# Altium schematic sheet Sensor.SchDoc
size A3
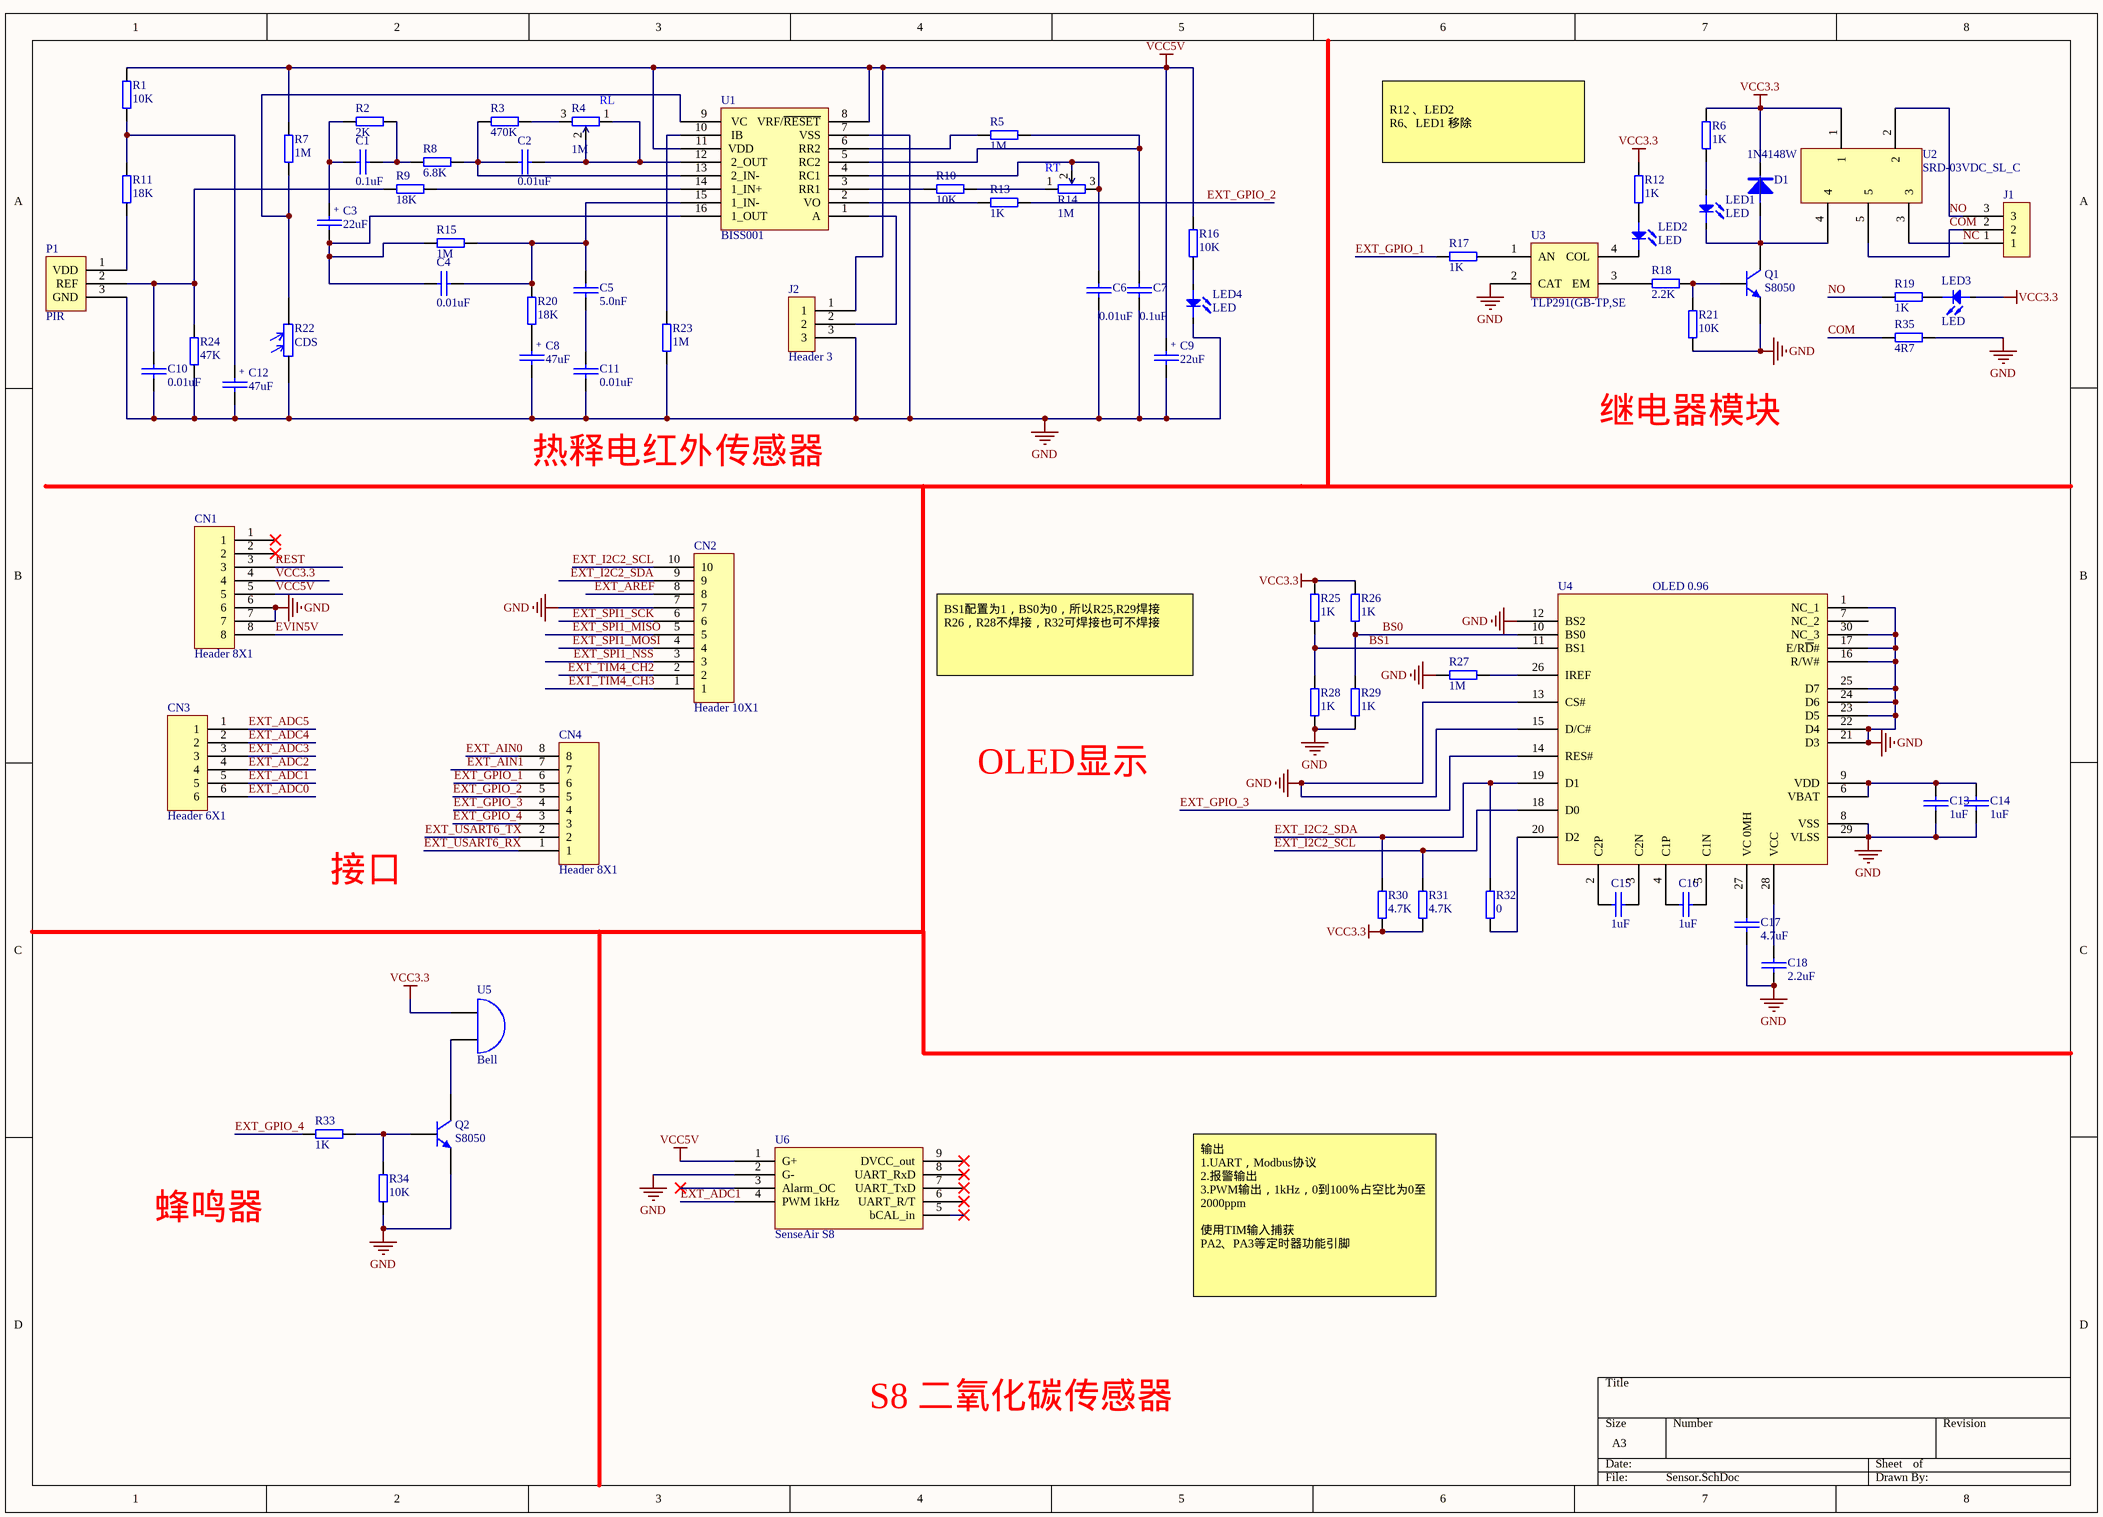
[diagram p0: Sensor.SchDoc]

## Parts
C1  0.1uF  [0603 - CAP]
C2  0.01uF  [0603 - CAP]
C3  22uF  [C-钽贴A(S)_3216M_18(12)]
C4  0.01uF  [0603 - CAP]
C5  5.0nF  [0603 - CAP]
C6  0.01uF  [0603 - CAP]
C7  0.1uF  [0603 - CAP]
C8  47uF  [C-钽贴A(S)_3216M_18(12)]
C9  22uF  [C-钽贴A(S)_3216M_18(12)]
C10  0.01uF  [0603 - CAP]
C11  0.01uF  [0603 - CAP]
C12  47uF  [C-钽贴A(S)_3216M_18(12)]
C13  1uF  [0603 - CAP]
C14  1uF  [0603 - CAP]
C15  1uF  [0603 - CAP]
C16  1uF  [0603 - CAP]
C17  4.7uF  [0603 - CAP]
C18  2.2uF  [0603 - CAP]
CN1  Header 8X1  [HDR1X8]
CN2  Header 10X1  [HDR1X10]
CN3  Header 6X1  [HDR1X6]
CN4  Header 8X1  [HDR1X8]
D1  1N4148W  [1N4148W]
J1  (no value)  [HDR1X3 - duplicate1]
J2  Header 3  [HDR1X3 - duplicate1]
LED1  LED  [0603-LED]
LED2  LED  [0603-LED]
LED3  LED  [0603-LED]
LED4  LED  [0603-LED]
P1  PIR  [PIR]
Q1  S8050  [TO-92_3]
Q2  S8050  [TO-92_3]
R1  10K  [0603 - RES]
R2  2K  [0603 - RES]
R3  470K  [0603 - RES]
R4  1M  [3296W]
R5  1M  [0603 - RES]
R6  1K  [0603 - RES]
R7  1M  [0603 - RES]
R8  6.8K  [0603 - RES]
R9  18K  [0603 - RES]
R10  10K  [0603 - RES]
R11  18K  [0603 - RES]
R12  1K  [0603 - RES]
R13  1K  [0603 - RES]
R14  1M  [3296W]
R15  1M  [0603 - RES]
R16  10K  [0603 - RES]
R17  1K  [0603 - RES]
R18  2.2K  [0603 - RES]
R19  1K  [0603 - RES]
R20  18K  [0603 - RES]
R21  10K  [0603 - RES]
R22  CDS  [RES-guangmin]
R23  1M  [0603 - RES]
R24  47K  [0603 - RES]
R25  1K  [0603 - RES]
R26  1K  [0603 - RES]
R27  1M  [0603 - RES]
R28  1K  [0603 - RES]
R29  1K  [0603 - RES]
R30  4.7K  [0603 - RES]
R31  4.7K  [0603 - RES]
R32  0  [0603 - RES]
R33  1K  [0603 - RES]
R34  10K  [0603 - RES]
R35  4R7  [0603 - RES]
U1  BISS001  [SOP-16_150mil]
U2  SRD-03VDC_SL_C  [SRD-03VDC-SL-C]
U3  TLP291(GB-TP,SE  [TLP291(GB-TP,SE]
U4  OLED 0.96  [oled 0.96]
U5  Bell  [BUZZER_mini]
U6  SenseAir S8  [SenseAir S8]

## Nets
GND: C6.2 C7.2 C8.2 C9.2 C10.2 C11.2 C12.2 C13.1 C14.1 C17.1 C18.1 CN1.6 CN1.7 CN2.7 J2.3 LED4.2 P1.3(GND) Q1.1(E) Q2.1(E) R21.2 R22.1 R23.1 R24.1 R27.2 R28.1 R29.1 R34.1 R35.2 U1.7(VSS) U3.2(CAT) U4.1(NC_1) U4.8(VSS) U4.12(BS2) U4.13(CS#) U4.15(D/C#) U4.16(R/W#) U4.17(E/R~{D}#) U4.21(D3) U4.22(D4) U4.23(D5) U4.24(D6) U4.25(D7) U4.29(VLSS) U4.30(NC_3) U6.2(G-)
VCC3.3: CN1.4 D1.2(K) LED3.1 R6.2 R12.2 R25.2 R26.2 R30.1 R31.1 U2.1 U5.1(A)
VCC5V: C9.1 CN1.5 J2.1 R1.2 R7.2 R16.2 U1.8(VRF/~{RESET}) U1.11(VDD) U6.1(G+)
BS0: R26.1 R29.2 U4.10(BS0)
BS1: R25.1 R28.2 U4.11(BS1)
COM: J1.2 R35.1 U2.5
EVIN5V: CN1.8
EXT_ADC0: CN3.6
EXT_ADC1: CN3.5 U6.4(PWM_1kHz)
EXT_ADC2: CN3.4
EXT_ADC3: CN3.3
EXT_ADC4: CN3.2
EXT_ADC5: CN3.1
EXT_AIN0: CN4.8
EXT_AIN1: CN4.7
EXT_AREF: CN2.8
EXT_GPIO_1: CN4.6 R17.1
EXT_GPIO_2: CN4.5 R13.2
EXT_GPIO_3: CN4.4 U4.14(RES#)
EXT_GPIO_4: CN4.3 R33.1
EXT_I2C2_SCL: CN2.10 R31.2 U4.18(D0)
EXT_I2C2_SDA: CN2.9 R30.2 R32.2 U4.19(D1)
EXT_SPI1_MISO: CN2.5
EXT_SPI1_MOSI: CN2.4
EXT_SPI1_NSS: CN2.3
EXT_SPI1_SCK: CN2.6
EXT_TIM4_CH2: CN2.2
EXT_TIM4_CH3: CN2.1
EXT_USART6_RX: CN4.1
EXT_USART6_TX: CN4.2
NC: J1.1 U2.3
NO: J1.3 R19.1 U2.2
REST: CN1.3
NetC1_1: C1.1 R2.2 R8.1
NetC1_2: C1.2 C3.1 R2.1
NetC2_1: C2.1 R3.1 R8.2 U1.13(2_IN-)
NetC2_2: C2.2 R4.1 R4.2 U1.12(2_OUT)
NetC3_2: C3.2 C4.1 R15.2 U1.16(1_OUT)
NetC4_2: C4.2 C5.1 R15.1 R20.2 U1.15(1_IN-)
NetC5_2: C5.2 C11.1
NetC6_1: C6.1 R14.2 R14.3 U1.4(RC1)
NetC7_1: C7.1 R5.1 U1.5(RC2)
NetC8_1: C8.1 R20.1
NetC10_1: C10.1 P1.2(REF) R9.2 R24.2
NetC12_1: C12.1 R1.1 R11.2
NetC13_2: C13.2 C14.2 U4.6(VBAT) U4.9(VDD)
NetC15_1: C15.1 U4.3(C2N)
NetC15_2: C15.2 U4.2(C2P)
NetC16_1: C16.1 U4.5(C1N)
NetC16_2: C16.2 U4.4(C1P)
NetC17_2: C17.2 U4.27(VC_0MH)
NetC18_2: C18.2 U4.28(VCC)
NetD1_1: D1.1(A) LED1.2 Q1.3(C) U2.4
NetJ2_2: J2.2 U1.1(A)
NetLED1_1: LED1.1 R6.1
NetLED2_1: LED2.1 R12.1
NetLED2_2: LED2.2 U3.4(COL)
NetLED3_2: LED3.2 R19.2
NetLED4_1: LED4.1 R16.1
NetP1_1: P1.1(VDD) R11.1
NetQ1_2: Q1.2(B) R18.1 R21.1
NetQ2_2: Q2.2(B) R33.2 R34.2
NetQ2_3: Q2.3(C) U5.2(B)
NetR3_2: R3.2 R4.3
NetR5_2: R5.2 U1.6(RR2)
NetR7_1: R7.1 R22.2 U1.9(VC)
NetR9_1: R9.1 U1.14(1_IN+)
NetR10_1: R10.1 R14.1
NetR10_2: R10.2 U1.3(RR1)
NetR13_1: R13.1 U1.2(VO)
NetR17_2: R17.2 U3.1(AN)
NetR18_2: R18.2 U3.3(EM)
NetR23_2: R23.2 U1.10(IB)
NetR27_1: R27.1 U4.26(IREF)
NetR32_1: R32.1 U4.20(D2)

Not connected (* = marked no-connect by the designer): CN1 1* 2*; U4 7(NC_2); U6 3(Alarm_OC)* 5(bCAL_in)* 6(UART_R/T)* 7(UART_TxD)* 8(UART_RxD)* 9(DVCC_out)*

## Notes on the sheet
- (near R4) RL
- (near R14) RT
- R12 、LED2
  R6、LED1 移除
- 继电器模块
- 热释电红外传感器
- BS1配置为1，BS0为0，所以R25,R29焊接
  R26，R28不焊接，R32可焊接也可不焊接
- OLED显示
- 接口
- 蜂鸣器
- 输出
  1.UART，Modbus协议
  2.报警输出
  3.PWM输出，1kHz，0到100％占空比为0至2000ppm
  使用TIM输入捕获
  PA2、PA3等定时器功能引脚
- S8 二氧化碳传感器
- (in symbol Capacity_electric) +

## Library data of the parts
C1 C7 = Capacity_normal: MAnufactor: YAGEO(国巨); Value: 100nF(104) ±10% 10V; Package: 0603
C2 C4 C6 C10 C11 = Capacity_normal: MAnufactor: YAGEO(国巨); Value: 10nF(103) ±10% 10V; Package: 0603
C3 C9 = Capacity_electric: Manufactor: SAMSUNG(三星); Value: 22uF(226) ±20% 6.3V; Package: 0603
C5 = Capacity_normal: MAnufactor: FH(风华); Value: 5.0nF(502) ±10% 50V; Package: 0603
C8 C12 = Capacity_electric: Manufactor: CEC(振华新云); Value: 47uF(476) ±10% 6.3V; Package: CASE-A_3216
C13-C16 = Capacity_normal: MAnufactor: YAGEO(国巨); Value: 1uF(105) ±10% 6.3V; Package: 0603
C17 = Capacity_normal: MAnufactor: muRata(村田); Value: 4.7uF ±10% 6.3V; Package: 0603
C18 = Capacity_normal: MAnufactor: AVX; Value: 2.2uF ±20% 4V; Package: 0603
CN1 CN4 = Header 8X1: Value: 排针 8X1 2.54mm; Manufactor: *
CN2 = Header 10X1: Value: 排针 10X1 2.54mm; Manufactor: *
CN3 = Header 6X1: Value: 排针 6X1 2.54mm; Manufactor: *
D1 = 1N4148W: Manufactor: YANGJIE(扬杰); Package: SOD-123; Value: 1N4148W
J1 J2 = Header 3: Header,3-pin; Manufactor: *; Package: 2mm 1X3排针
LED1-LED4 = LED: Manufactor: 台湾亿光; Package: 0603; Value: *
P1 = PIR: Manufactor: 森霸; Value: AS312; Package: Through Hole
Q1 Q2 = S8050: Manufactor: LGE(鲁光); Package: TO-92; Value: S8050
R1 R10 R16 R21 R24 R34 = RES: Manufactor: UNI-ROYAL(厚声); Value: 10KΩ ±1%; Package: 0603
R2 = RES: Manufactor: YAGEO(国巨); Value: 2KΩ(2K) ±1% 50PPM; Package: 0603
R3 = RES: Manufactor: YAGEO(国巨); Value: 470KΩ(470K) ±1% 50PPM; Package: 0603
R4 R14 = 可调电阻: Manufactor: BOCHEN(博晨); Value: 1MΩ ±10% ±250ppm/℃; Package: 3296W
R5 R7 R15 R23 R27 = RES: Manufactor: UNI-ROYAL(厚声); Value: 1MΩ ±1%; Package: 0603
R6 R12 R13 R17 R19 R25 R26 R28 R29 R33 = RES: Manufactor: YAGEO(国巨); Value: 1KΩ(1K) ±1% 50PPM; Package: 0603
R8 = RES: Manufactor: YAGEO(国巨); Value: 6.8KΩ(6801) ±1%; Package: 0603
R9 R11 R20 = RES: Manufactor: YAGEO(国巨); Value: 18KΩ(1802) ±1%; Package: 0603
R18 = RES: Manufactor: YAGEO(国巨); Value: 2.2KΩ(2201) ±1%; Package: 0603
R22 = 光敏电阻: Manufactor: JCHL(晶创和立); Value: 光敏电阻; Package: Through Hole
R30 R31 = RES: Manufactor: YAGEO(国巨); Value: 4.7KΩ(472) ±5%; Package: 0603
R32 = RES: Manufactor: YAGEO(国巨); Value: 0Ω(0000) ±1%; Package: 0603
R35 = RES: Manufactor: ROHM(罗姆); Value: 4.7Ω(4R7) ±5%; Package: 0603
U1 = BISS001: 热释电传感器; Manufactor: 无锡中微; Value: BISS0001; Package: SOP-16_150mil
U2 = SRD-03VDC_SL_C: SL，3V 继电器模块; Manufactor: 松乐; Value: SRD-03VDC-SL-C 蓝色; Package: Through Hole
U3 = TLP291(GB-TP,SE: Manufactor: TOSHIBA(东芝); Package: SOP-4_P1.27; Value: TLP291(GB-TP,SE
U4 = OLED 0.96: 中景园 0.96寸OLED 30pin; Value: oled 0.96 30pin; Manufactor: 中景园; Package: 0.96
U5 = Bell: Manufactor: Fengming(锋鸣电子); Value: 电磁式有源一体蜂鸣器3V; Package: Through Hole,9x5.5mm
U6 = SenseAir S8: Manufactor: 瑞士SenseAir; Value: Sweden SenseAir imported CO2 sensor S8-0053, 0-2000PPM; Package: *